# Altium schematic sheet 8266_Download.SchDoc
size A4; SheetNumber: 1; SheetTotal: 1
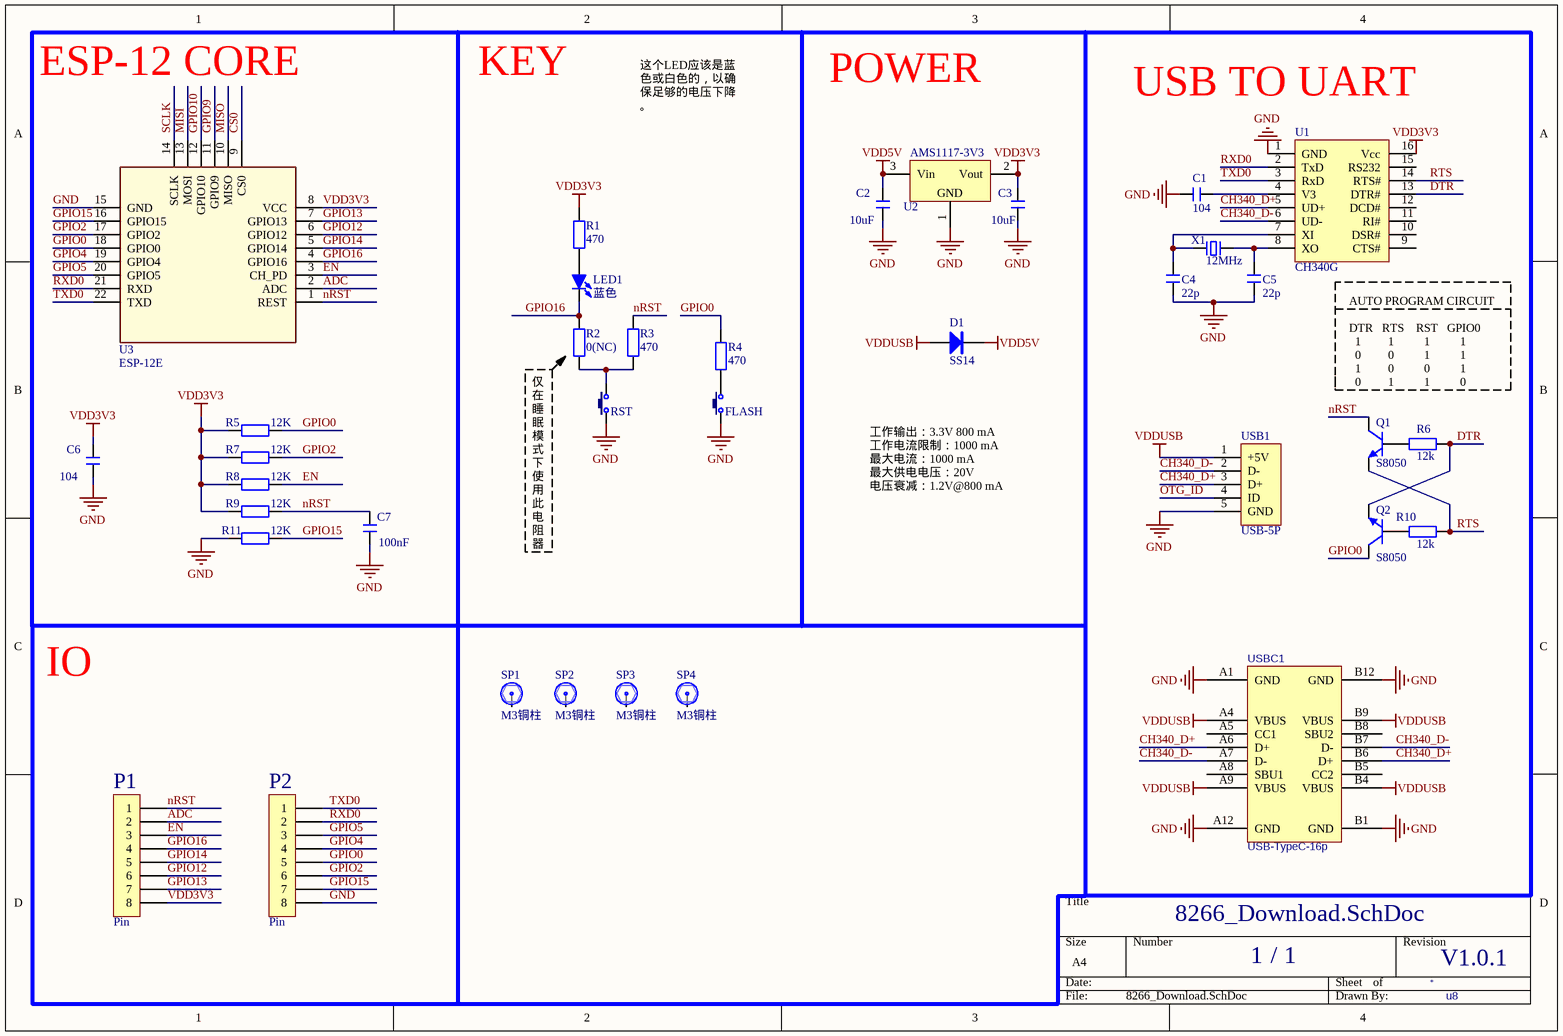
[diagram p0: 8266_Download.SchDoc]

## Parts
C1  104  [C 0603_M]
C2  10uF  [C 0603_M]
C3  10uF  [C 0603_M]
C4  22p  [C 0603_M]
C5  22p  [C 0603_M]
C6  104  [C 0603_M]
C7  100nF  [C 0603_M]
D1  SS14  [SMA]
FLASH  3x6x5  [TSW SMD-3*6*2.5]  (value not drawn)
LED1  蓝色  [LED 0603B]
P1  Pin  [Header_D_8_8x1_2.54]
P2  Pin  [Header_D_8_8x1_2.54]
Q1  S8050  [SOT23-3N]
Q2  S8050  [SOT23-3N]
R1  470  [R 0603_M]
R2  0(NC)  [R 0603_M]
R3  470  [R 0603_M]
R4  470  [R 0603_M]
R5  12K  [R 0603_M]
R6  12k  [R 0603_M]
R7  12K  [R 0603_M]
R8  12K  [R 0603_M]
R9  12K  [R 0603_M]
R10  12k  [R 0603_M]
R11  12K  [R 0603_M]
RST  3x6x5  [TSW SMD-3*6*2.5]  (value not drawn)
SP1  M3铜柱  [M3x4+6_N]
SP2  M3铜柱  [M3x4+6_N]
SP3  M3铜柱  [M3x4+6_N]
SP4  M3铜柱  [M3x4+6_N]
U1  CH340G  [SOP16_L]
U2  AMS1117-3V3  [SOT223_L]
U3  ESP-12E  [esp8266]
USB1  USB-5P  [USB-MICRO_D]
USBC1  USB-TypeC-16p  [TYPE-C-USB-16P-1]
X1  12MHz  [OSC HC-49S]

## Nets
GND: C1.2 C2.2 C3.2 C4.2 C5.2 C6.2 C7.1 FLASH.1 P2.8 R11.1 RST.1 U1.1(GND) U2.1(GND) U3.15(GND) USB1.5(GND) USBC1.A1(GND) USBC1.A12(GND) USBC1.B1(GND) USBC1.B12(GND)
VDD3V3: C3.1 C6.1 P1.8 R1.2 R5.1 R7.1 R8.1 R9.1 U1.16(Vcc) U2.2(Vout) U3.8(VCC)
VDD5V: C2.1 D1.2(K) U2.3(Vin)
VDDUSB: D1.1(A) USB1.1(+5V) USBC1.A4(VBUS) USBC1.A9(VBUS) USBC1.B4(VBUS) USBC1.B9(VBUS)
ADC: P1.2 U3.2(ADC)
CH340_D+: U1.5(UD+) USB1.3(D+) USBC1.A6(D+) USBC1.B6(D+)
CH340_D-: U1.6(UD-) USB1.2(D-) USBC1.A7(D-) USBC1.B7(D-)
CS0: U3.9(CS0)
DTR: Q2.2(E) R6.1 U1.13(DTR#)
EN: P1.3 R8.2 U3.3(CH_PD)
GPIO0: P2.5 Q2.3(C) R4.2 R5.2 U3.18(GPIO0)
GPIO2: P2.6 R7.2 U3.17(GPIO2)
GPIO4: P2.4 U3.19(GPIO4)
GPIO5: P2.3 U3.20(GPIO5)
GPIO9: U3.11(GPIO9)
GPIO10: U3.12(GPIO10)
GPIO12: P1.6 U3.6(GPIO12)
GPIO13: P1.7 U3.7(GPIO13)
GPIO14: P1.5 U3.5(GPIO14)
GPIO15: P2.7 R11.2 U3.16(GPIO15)
GPIO16: LED1.2(K) P1.4 R2.2 U3.4(GPIO16)
MISI: U3.13(MOSI)
MISO: U3.10(MISO)
nRST: C7.2 P1.1 Q1.3(C) R3.2 R9.2 U3.1(REST)
OTG_ID: USB1.4(ID)
RTS: Q1.2(E) R10.1 U1.14(RTS#)
RXD0: P2.2 U1.2(TxD) U3.21(RXD)
SCLK: U3.14(SCLK)
TXD0: P2.1 U1.3(RxD) U3.22(TXD)
NetC1_1: C1.1 U1.4(V3)
NetC4_1: C4.1 U1.7(XI) X1.1
NetC5_1: C5.1 U1.8(XO) X1.2
NetFLASH_2: FLASH.2 R4.1
NetLED1_1: LED1.1(A) R1.1
NetQ1_1: Q1.1(B) R6.2
NetQ2_1: Q2.1(B) R10.2
NetR2_1: R2.1 R3.1 RST.2

Not connected (* = marked no-connect by the designer): SP1 1; SP2 1; SP3 1; SP4 1; U1 9(CTS#) 10(DSR#) 11(RI#) 12(DCD#) 15(RS232); USBC1 A5(CC1) A8(SBU1) B5(CC2) B8(SBU2)

## Notes on the sheet
- ESP-12 CORE
- KEY
- 这个LED应该是蓝色或白色的，以确保足够的电压下降。
- POWER
- (near U1) USB TO UART
- AUTO PROGRAM CIRCUIT
  DTR   RTS    RST   GPIO0
  1         1          1          1
  0         0          1          1
  1         0          0          1
  0         1          1          0
- 工作输出：3.3V 800 mA
  工作电流限制：1000 mA
  最大电流：1000 mA
  最大供电电压：20V
  电压衰减：1.2V@800 mA
- 仅在睡眠模式下使用此电阻器
- IO
- /
- V1.0.1
- u8

## Library data of the parts
C1-C7 = C: 无极性贴片电容; 版权归属: 源创客; BOM名称: 无极性贴片电容; 学习资源: www.ooocke.com
D1 = SS14: 肖特基二极管; 版权归属: 源创客; 属性: 40V/1A; BOM名称: 肖特基二极管; 学习资源: www.ooocke.com
FLASH RST = TSW 3x6: 3x6轻触开关; 版权归属: 源创客; BOM名称: 3x6轻触开关; 学习资源: www.ooocke.com
LED1 = LED-SMD: 贴片LED; 版权归属: 源创客; BOM名称: 贴片LED; 学习资源: www.ooocke.com
P1 P2 = Header_D_8_8x1_2.54
Q1 Q2 = 8050-SMD: 高频放大-NPN型; 版权归属: 源创客; 属性: 40V 1.5A 1W 100MHZ; BOM名称: 高频放大-NPN型; 学习资源: www.ooocke.com
R1-R11 = R: 贴片电阻; 版权归属: 源创客; BOM名称: 贴片电阻; 学习资源: www.ooocke.com
SP1-SP4 = 铜柱加头大焊盘: 铜柱; 版权归属: 源创客; BOM名称: 铜柱; 学习资源: www.ooocke.com
U1 = CH340G: 串口转USB; 版权归属: 源创客; BOM名称: 串口转USB; 学习资源: www.ooocke.com
U2 = AMS1117: 三端稳压芯片; BOM名称: 稳压芯片; 版权归属: 源创客; 学习资源: www.ooocke.com
USB1 = USB-5P: 微型USB母座; 版权归属: 源创客; BOM名称: 微型USB母座; 学习资源: www.ooocke.com
X1 = XTAL-2P: 2脚无源脚晶振; 版权归属: 源创客; BOM名称: 2脚无源脚晶振; 学习资源: www.ooocke.com